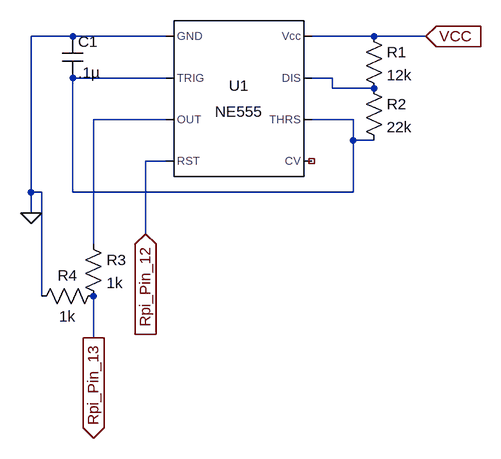
[diagram p0: schematic Timer.asc]
Timer.asc, the LTspice schematic file:
Version 4
SHEET 1 880 784
WIRE -80 80 -144 80
WIRE 64 80 -80 80
WIRE 384 80 288 80
WIRE 464 80 384 80
WIRE 64 144 -80 144
WIRE 320 144 288 144
WIRE 320 160 320 144
WIRE 384 160 320 160
WIRE 64 208 -48 208
WIRE 352 208 288 208
WIRE 352 240 352 208
WIRE 384 240 352 240
WIRE 64 272 32 272
WIRE -144 320 -144 80
WIRE -128 320 -144 320
WIRE -80 320 -80 144
WIRE 352 320 352 240
WIRE 352 320 -80 320
WIRE -144 352 -144 320
WIRE 32 384 32 272
WIRE -48 400 -48 208
WIRE -128 480 -128 320
WIRE -48 544 -48 480
FLAG -144 352 0
FLAG 464 80 VCC
IOPIN 464 80 In
FLAG 32 384 Rpi_Pin_12
IOPIN 32 384 In
FLAG -48 544 Rpi_Pin_13
IOPIN -48 544 Out
SYMBOL Misc\\NE555 176 176 R0
SYMATTR InstName U1
SYMBOL cap -96 80 R0
SYMATTR InstName C1
SYMATTR Value .1µ
SYMBOL res 368 64 R0
SYMATTR InstName R1
SYMATTR Value 12k
SYMBOL res 368 144 R0
SYMATTR InstName R2
SYMATTR Value 22k
SYMBOL res -64 384 R0
SYMATTR InstName R3
SYMATTR Value 1k
SYMBOL res -32 464 R90
WINDOW 0 0 56 VBottom 2
WINDOW 3 32 56 VTop 2
SYMATTR InstName R4
SYMATTR Value 1k

The netlist it stands for:
* Timer.asc
XU1 0 N001 N003 Rpi_Pin_12 NC_01 N001 N002 VCC NE555  ; pins GND TRIG OUT RST CV THRS DIS Vcc
C1 0 N001 .1µ
R1 VCC N002 12k
R2 N002 N001 22k
R3 N003 Rpi_Pin_13 1k
R4 Rpi_Pin_13 0 1k
.lib NE555.sub
.backanno
.end